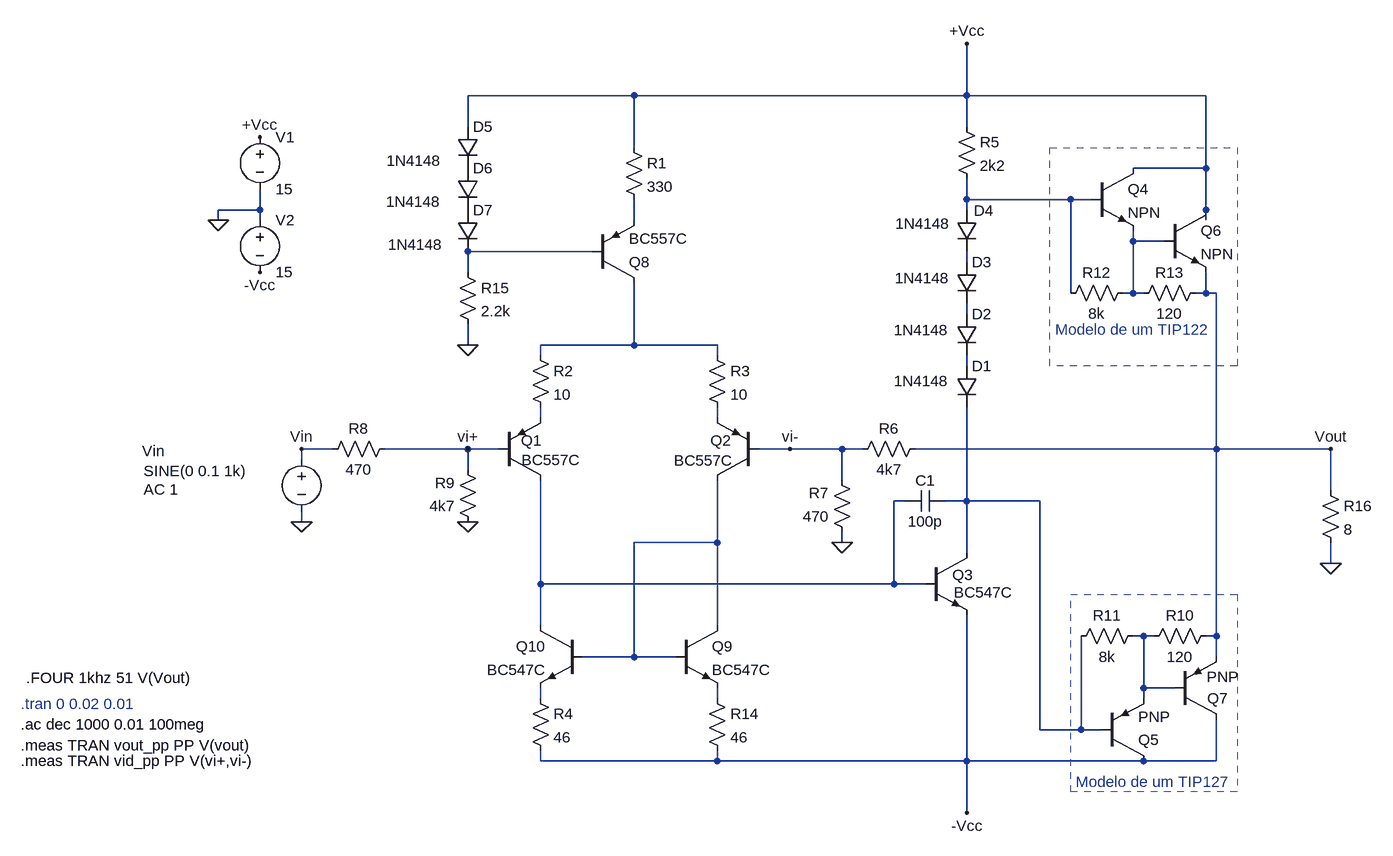
[diagram p0: schematic Amp_v1.asc]
Amp_v1.asc, the LTspice schematic file:
Version 4.1
SHEET 1 1840 996
WIRE 112 -384 -144 -384
WIRE 624 -384 624 -464
WIRE 624 -384 112 -384
WIRE 992 -384 624 -384
WIRE -144 -336 -144 -384
WIRE 624 -336 624 -384
WIRE 112 -304 112 -384
WIRE 992 -272 992 -384
WIRE 992 -272 880 -272
WIRE 624 -224 624 -256
WIRE 784 -224 624 -224
WIRE 816 -224 784 -224
WIRE -464 -208 -464 -240
WIRE -464 -208 -528 -208
WIRE 624 -208 624 -224
WIRE 992 -208 992 -272
WIRE -528 -192 -528 -208
WIRE -464 -192 -464 -208
WIRE 112 -192 112 -224
WIRE 992 -192 992 -208
WIRE 880 -160 880 -176
WIRE 928 -160 880 -160
WIRE 48 -144 -144 -144
WIRE 624 -128 624 -144
WIRE -144 -112 -144 -144
WIRE 784 -80 784 -224
WIRE 880 -80 880 -160
WIRE 880 -80 864 -80
WIRE 896 -80 880 -80
WIRE 992 -80 992 -112
WIRE 992 -80 976 -80
WIRE 1008 -80 992 -80
WIRE 624 -48 624 -64
WIRE -144 0 -144 -32
WIRE 112 0 112 -96
WIRE 112 0 -32 0
WIRE 240 0 112 0
WIRE -32 16 -32 0
WIRE 240 16 240 0
WIRE 624 32 624 16
WIRE -32 112 -32 96
WIRE 240 112 240 96
WIRE -352 160 -400 160
WIRE -144 160 -272 160
WIRE -96 160 -144 160
WIRE 352 160 304 160
WIRE 432 160 352 160
WIRE 464 160 432 160
WIRE 1008 160 1008 -80
WIRE 1008 160 544 160
WIRE 1184 160 1008 160
WIRE -400 176 -400 160
WIRE -144 192 -144 160
WIRE 432 208 432 160
WIRE 1184 224 1184 160
WIRE 528 240 512 240
WIRE 624 240 624 96
WIRE 624 240 592 240
WIRE 736 240 624 240
WIRE -400 272 -400 256
WIRE 240 304 240 208
WIRE 240 304 112 304
WIRE 432 304 432 288
WIRE 624 320 624 240
WIRE 1184 336 1184 304
WIRE -32 368 -32 208
WIRE 512 368 512 240
WIRE 512 368 -32 368
WIRE 560 368 512 368
WIRE -32 432 -32 368
WIRE 240 432 240 304
WIRE 896 448 880 448
WIRE 912 448 896 448
WIRE 1008 448 1008 160
WIRE 1008 448 992 448
WIRE 112 480 112 304
WIRE 112 480 32 480
WIRE 176 480 112 480
WIRE 1008 480 1008 448
WIRE 896 528 896 448
WIRE 944 528 896 528
WIRE -32 544 -32 528
WIRE 240 544 240 528
WIRE 896 544 896 528
WIRE 736 592 736 240
WIRE 800 592 800 448
WIRE 800 592 736 592
WIRE 832 592 800 592
WIRE -32 640 -32 624
WIRE 240 640 240 624
WIRE 240 640 -32 640
WIRE 624 640 624 416
WIRE 624 640 240 640
WIRE 896 640 624 640
WIRE 1008 640 1008 576
WIRE 1008 640 896 640
WIRE 624 720 624 640
FLAG -400 272 0
FLAG -528 -192 0
FLAG -464 -320 +Vcc
FLAG 624 -464 +Vcc
FLAG -464 -112 -Vcc
FLAG 624 720 -Vcc
FLAG -144 272 0
FLAG 1184 160 Vout
FLAG 1184 336 0
FLAG -144 0 0
FLAG -144 160 vi+
FLAG 352 160 vi-
FLAG -400 160 Vin
FLAG 432 304 0
SYMBOL voltage -464 -336 R0
WINDOW 123 24 44 Left 2
WINDOW 39 0 0 Left 0
SYMATTR InstName V1
SYMATTR Value 15
SYMBOL voltage -464 -208 R0
WINDOW 123 0 0 Left 0
WINDOW 39 0 0 Left 0
SYMATTR InstName V2
SYMATTR Value 15
SYMBOL voltage -400 160 R0
WINDOW 123 -243 62 Left 2
WINDOW 39 24 152 Left 0
WINDOW 0 -245 3 Left 2
WINDOW 3 -243 34 Left 2
SYMATTR Value2 AC 1
SYMATTR InstName Vin
SYMATTR Value SINE(0 0.1 1k)
SYMBOL res -48 0 R0
SYMATTR InstName R2
SYMATTR Value 10
SYMBOL res 224 0 R0
SYMATTR InstName R3
SYMATTR Value 10
SYMBOL res 608 -352 R0
SYMATTR InstName R5
SYMATTR Value 2k2
SYMBOL res 560 144 R90
WINDOW 0 0 56 VBottom 2
WINDOW 3 32 56 VTop 2
SYMATTR InstName R6
SYMATTR Value 4k7
SYMBOL res 448 304 R180
WINDOW 0 36 76 Left 2
WINDOW 3 36 40 Left 2
SYMATTR InstName R7
SYMATTR Value 470
SYMBOL res 1008 432 R90
WINDOW 0 0 56 VBottom 2
WINDOW 3 32 56 VTop 2
SYMATTR InstName R10
SYMATTR Value 120
SYMBOL res 896 432 R90
WINDOW 0 0 56 VBottom 2
WINDOW 3 32 56 VTop 2
SYMATTR InstName R11
SYMATTR Value 8k
SYMBOL res 880 -96 R90
WINDOW 0 0 56 VBottom 2
WINDOW 3 32 56 VTop 2
SYMATTR InstName R12
SYMATTR Value 8k
SYMBOL res 992 -96 R90
WINDOW 0 0 56 VBottom 2
WINDOW 3 32 56 VTop 2
SYMATTR InstName R13
SYMATTR Value 120
SYMBOL diode 608 32 R0
WINDOW 3 -96 23 Left 2
SYMATTR Value 1N4148
SYMATTR InstName D1
SYMBOL diode 608 -48 R0
WINDOW 3 -96 25 Left 2
SYMATTR Value 1N4148
SYMATTR InstName D2
SYMBOL diode 608 -128 R0
WINDOW 3 -95 25 Left 2
SYMATTR Value 1N4148
SYMATTR InstName D3
SYMBOL diode 608 -208 R0
WINDOW 0 27 1 Left 2
WINDOW 3 -94 21 Left 2
SYMATTR InstName D4
SYMATTR Value 1N4148
SYMBOL cap 592 224 R90
WINDOW 0 0 32 VBottom 2
WINDOW 3 32 32 VTop 2
SYMATTR InstName C1
SYMATTR Value 100p
SYMBOL npn 560 320 R0
WINDOW 0 42 34 Left 2
WINDOW 3 44 61 Left 2
SYMATTR InstName Q3
SYMATTR Value BC547C
SYMBOL npn 816 -272 R0
SYMATTR InstName Q4
SYMBOL pnp 832 640 M180
SYMATTR InstName Q5
SYMBOL npn 928 -208 R0
SYMATTR InstName Q6
SYMBOL pnp 944 576 M180
WINDOW 0 50 32 Left 2
WINDOW 3 49 65 Left 2
SYMATTR InstName Q7
SYMBOL pnp -96 208 M180
WINDOW 0 34 61 Left 2
WINDOW 3 35 31 Left 2
SYMATTR InstName Q1
SYMATTR Value BC557C
SYMBOL pnp 304 208 R180
WINDOW 0 42 61 Left 2
WINDOW 3 40 30 Left 2
SYMATTR InstName Q2
SYMATTR Value BC557C
SYMBOL res -256 144 R90
WINDOW 0 0 56 VBottom 2
WINDOW 3 32 56 VTop 2
SYMATTR InstName R8
SYMATTR Value 470
SYMBOL res -128 288 R180
WINDOW 0 36 76 Left 2
WINDOW 3 36 40 Left 2
SYMATTR InstName R9
SYMATTR Value 4k7
SYMBOL res -160 -128 R0
SYMATTR InstName R15
SYMATTR Value 2.2k
SYMBOL res 96 -320 R0
SYMATTR InstName R1
SYMATTR Value 330
SYMBOL pnp 48 -96 M180
SYMATTR InstName Q8
SYMATTR Value BC557C
SYMBOL diode -160 -336 R0
WINDOW 3 -109 52 Left 2
SYMATTR Value 1N4148
SYMATTR InstName D5
SYMBOL diode -160 -272 R0
WINDOW 3 -110 51 Left 2
SYMATTR Value 1N4148
SYMATTR InstName D6
SYMBOL diode -160 -208 R0
WINDOW 3 -107 53 Left 2
SYMATTR Value 1N4148
SYMATTR InstName D7
SYMBOL npn 176 432 R0
SYMATTR InstName Q9
SYMATTR Value BC547C
SYMBOL npn 32 432 M0
SYMATTR InstName Q10
SYMATTR Value BC547C
SYMBOL res -48 528 R0
SYMATTR InstName R4
SYMATTR Value 46
SYMBOL res 224 528 R0
SYMATTR InstName R14
SYMATTR Value 46
SYMBOL res 1168 208 R0
SYMATTR InstName R16
SYMATTR Value 8
TEXT -832 552 Left 2 ;.tran 0 0.02 0.01
TEXT -824 512 Left 2 !.FOUR 1khz 51 V(Vout)
TEXT 760 -24 Left 2 ;Modelo de um TIP122
TEXT 792 672 Left 2 ;Modelo de um TIP127
TEXT -832 584 Left 2 !.ac dec 1000 0.01 100meg
TEXT -832 616 Left 2 !.meas TRAN vout_pp PP V(vout)
TEXT -832 640 Left 2 !.meas TRAN vid_pp PP V(vi+,vi-)
RECTANGLE Normal 1040 32 752 -304 2
RECTANGLE Normal 1040 688 784 384 2

The netlist it stands for:
* Amp_v1.asc
V1 +Vcc 0 15
V2 0 -Vcc 15
Vin Vin 0 SINE(0 0.1 1k) AC 1
R2 N007 N009 10
R3 N007 N010 10
R5 +Vcc N001 2k2
R6 Vout vi- 4k7
R7 0 vi- 470
R10 Vout N014 120
R11 N014 N012 8k
R12 N003 N001 8k
R13 Vout N003 120
D1 N008 N012 1N4148
D2 N006 N008 1N4148
D3 N005 N006 1N4148
D4 N001 N005 1N4148
C1 N012 N011 100p
Q3 N012 N011 -Vcc 0 BC547C
Q4 +Vcc N001 N003 0 NPN
Q5 -Vcc N012 N014 0 PNP
Q6 +Vcc N003 Vout 0 NPN
Q7 -Vcc N014 Vout 0 PNP
Q1 N011 vi+ N009 0 BC557C
Q2 N013 vi- N010 0 BC557C
R8 vi+ Vin 470
R9 0 vi+ 4k7
R15 N004 0 2.2k
R1 +Vcc N002 330
Q8 N007 N004 N002 0 BC557C
D5 +Vcc P001 1N4148
D6 P001 P002 1N4148
D7 P002 N004 1N4148
Q9 N013 N013 N016 0 BC547C
Q10 N011 N013 N015 0 BC547C
R4 N015 -Vcc 46
R14 N016 -Vcc 46
R16 Vout 0 8
.model D D
.lib standard.dio
.model NPN NPN
.model PNP PNP
.lib standard.bjt
* .tran 0 0.02 0.01
.FOUR 1khz 51 V(Vout)
* Modelo de um TIP122
* Modelo de um TIP127
.ac dec 1000 0.01 100meg
.meas TRAN vout_pp PP V(vout)
.meas TRAN vid_pp PP V(vi+,vi-)
.backanno
.end